# Altium schematic sheet 407-exp.schdoc
size A4
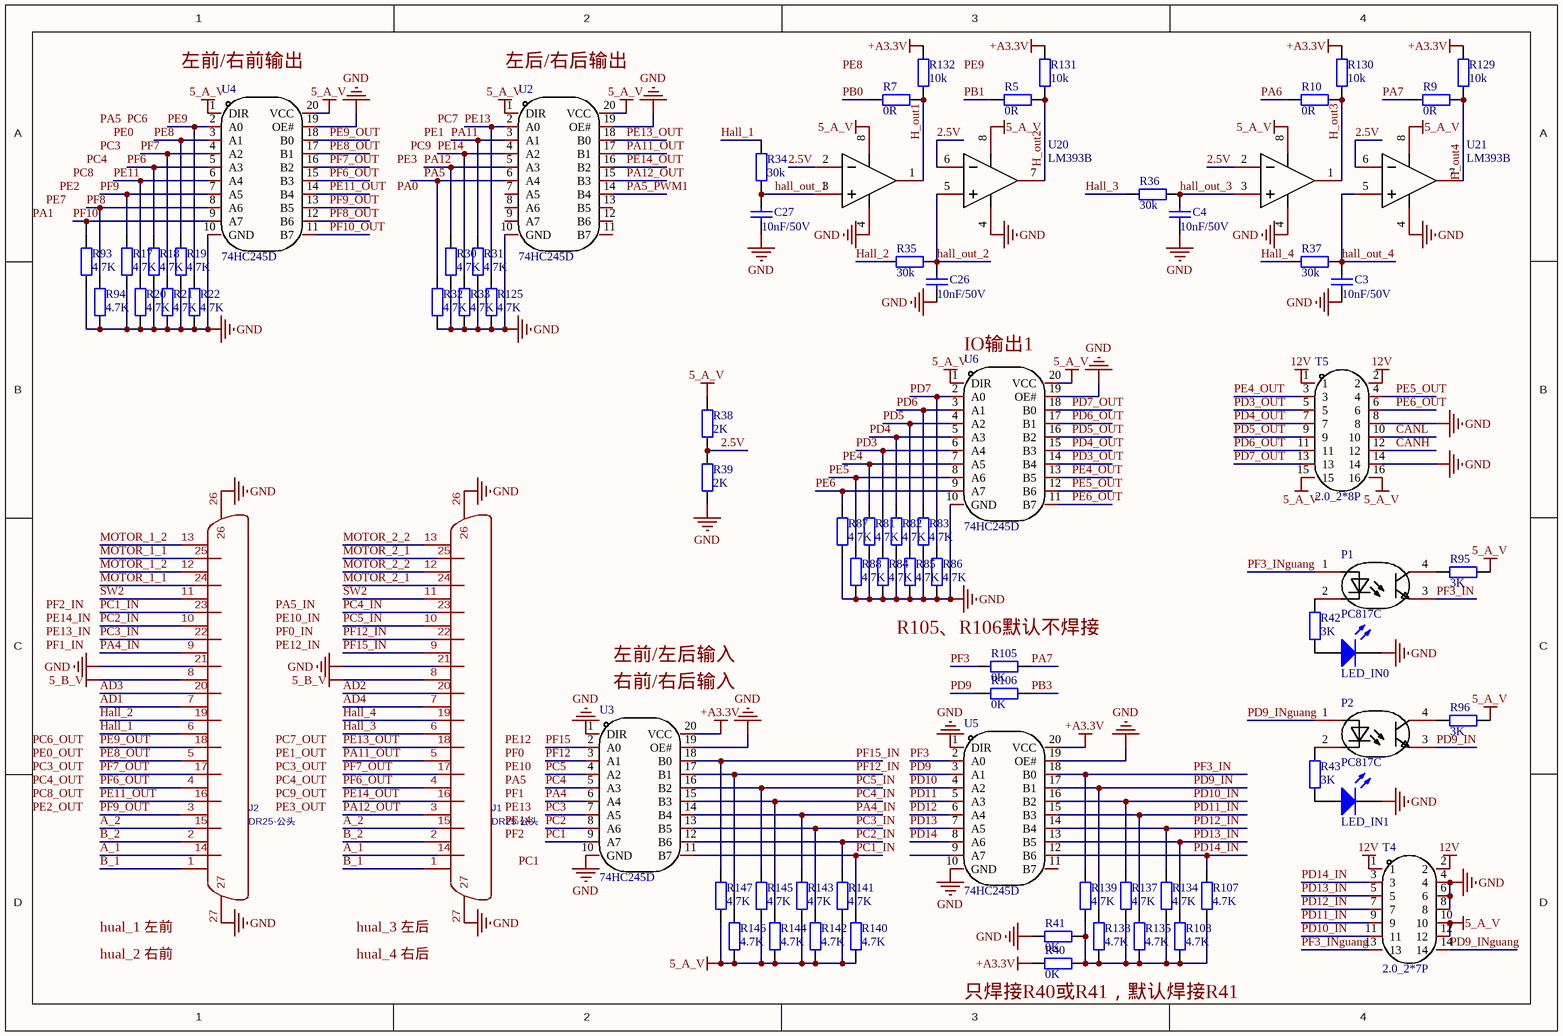
[diagram p0: 407-exp.schdoc]

## Parts
C3  10nF/50V
C4  10nF/50V
C26  10nF/50V
C27  10nF/50V
J1  DR25-公头
J2  DR25-公头
LED_IN0  LED  [LED]  (value not drawn)
LED_IN1  LED  [LED]  (value not drawn)
P1  PC817C  [PC817C]
P2  PC817C  [PC817C]
R5  0R  [R0603_L]
R7  0R  [R0603_L]
R9  0R  [R0603_L]
R10  0R  [R0603_L]
R17  4.7K  [R0603_L]
R18  4.7K  [R0603_L]
R19  4.7K  [R0603_L]
R20  4.7K  [R0603_L]
R21  4.7K  [R0603_L]
R22  4.7K  [R0603_L]
R30  4.7K  [R0603_L]
R31  4.7K  [R0603_L]
R32  4.7K  [R0603_L]
R33  4.7K  [R0603_L]
R34  30k  [R0603_L]
R35  30k  [R0603_L]
R36  30k  [R0603_L]
R37  30k  [R0603_L]
R38  2K
R39  2K
R40  0K  [R0603_L]
R41  0K  [R0603_L]
R42  3K
R43  3K
R81  4.7K
R82  4.7K
R83  4.7K
R84  4.7K
R85  4.7K
R86  4.7K
R87  4.7K
R88  4.7K
R93  4.7K  [R0603_L]
R94  4.7K  [R0603_L]
R95  3K
R96  3K
R105  0K  [R0603_L]
R106  0K  [R0603_L]
R107  4.7K
R108  4.7K
R125  4.7K  [R0603_L]
R129  10k  [R0603_L]
R130  10k  [R0603_L]
R131  10k  [R0603_L]
R132  10k  [R0603_L]
R134  4.7K
R135  4.7K
R137  4.7K
R138  4.7K
R139  4.7K
R140  4.7K  [R0603_L]
R141  4.7K  [R0603_L]
R142  4.7K  [R0603_L]
R143  4.7K  [R0603_L]
R144  4.7K  [R0603_L]
R145  4.7K  [R0603_L]
R146  4.7K  [R0603_L]
R147  4.7K  [R0603_L]
T4  2.0_2*7P  [2.0_2*7P]
T5  2.0_2*8P  [2.0_2*8P]
U2  74HC245D  [74HC245D]
U3  74HC245D  [74HC245D]
U4  74HC245D  [74HC245D]
U5  74HC245D  [74HC245D]
U6  74HC245D  [74HC245D]
U20  LM393B  [LM393B]
U21  LM393B  [LM393B]

## Nets
5_A_V: R38.1 R95.2 R96.2 R140.1 R141.1 R142.1 R143.1 R144.1 R145.1 R146.1 R147.1 T4.10 T4.12 T5.15 T5.16 U2.1(DIR) U2.20(VCC) U4.1(DIR) U4.20(VCC) U6.1(DIR) U6.20(VCC) U20.8(VCC) U21.8(VCC)
5_B_V: J1.8 J2.8
12V: T4.1 T4.2 T5.1 T5.2
+A3.3V: R40.1 R129.1 R130.1 R131.1 R132.1 U3.20(VCC) U5.20(VCC)
GND: C3.2 C4.2 C26.2 C27.2 J1.21 J1.26 J1.27 J2.21 J2.26 J2.27 LED_IN0.2(K) LED_IN1.2(K) R17.1 R18.1 R19.1 R20.1 R21.1 R22.1 R30.1 R31.1 R32.1 R33.1 R39.2 R41.1 R81.1 R82.1 R83.1 R84.1 R85.1 R86.1 R87.1 R88.1 R93.1 R94.1 R125.1 T4.4 T4.6 T4.8 T5.8 T5.14 U2.10(GND) U2.19(OE#) U3.1(DIR) U3.10(GND) U3.19(OE#) U4.10(GND) U4.19(OE#) U5.1(DIR) U5.10(GND) U5.19(OE#) U6.10(GND) U6.19(OE#) U20.4(GND) U21.4(GND)
2.5V: R38.2 R39.1 U20.2(1IN-) U20.6(1IN-) U21.2(1IN-) U21.6(1IN-)
A_1: J1.14 J2.14
A_2: J1.15 J2.15
AD1: J2.7
AD2: J1.20
AD3: J2.20
AD4: J1.7
B_1: J1.1 J2.1
B_2: J1.2 J2.2
CANH: T5.12
CANL: T5.10
H_out1: R7.2 R132.2 U20.1(1OUT)
H_out2: R5.2 R131.2 U20.7(1OUT)
H_out3: R10.2 R130.2 U21.1(1OUT)
H_out4: R9.2 R129.2 U21.7(1OUT)
Hall_1: J2.6 R34.1
Hall_2: J2.19 R35.1
Hall_3: J1.6 R36.1
Hall_4: J1.19 R37.1
hall_out_1: C27.1 R34.2 U20.3(1IN+)
hall_out_2: C26.1 R35.2 U20.5(1IN+)
hall_out_3: C4.1 R36.2 U21.3(1IN+)
hall_out_4: C3.1 R37.2 U21.5(1IN+)
MOTOR_1_1: J2.24 J2.25
MOTOR_1_2: J2.12 J2.13
MOTOR_2_1: J1.24 J1.25
MOTOR_2_2: J1.12 J1.13
PA4: U3.6(A4)
PA4_IN: J2.9 R143.2 U3.14(B4)
PA5: R32.2 U2.6(A4)
PA5_PWM1: U2.14(B4)
PA6: R10.1
PA7: R9.1 R105.1
PA11: R31.2 U2.3(A1)
PA11_OUT: J1.5 U2.17(B1)
PA12: R30.2 U2.5(A3)
PA12_OUT: J1.3 U2.15(B3)
PB0: R7.1
PB1: R5.1
PB3: R106.1
PC1: U3.9(A7)
PC1_IN: J2.23 R140.2 U3.11(B7)
PC2: U3.8(A6)
PC2_IN: J2.10 R141.2 U3.12(B6)
PC3: U3.7(A5)
PC3_IN: J2.22 R142.2 U3.13(B5)
PC4: U3.5(A3)
PC4_IN: J1.23 R144.2 U3.15(B3)
PC5: U3.4(A2)
PC5_IN: J1.10 R145.2 U3.16(B2)
PD3: R84.2 U6.6(A4)
PD3_OUT: T5.5 U6.14(B4)
PD4: R82.2 U6.5(A3)
PD4_OUT: T5.7 U6.15(B3)
PD5: R85.2 U6.4(A2)
PD5_OUT: T5.9 U6.16(B2)
PD6: R83.2 U6.3(A1)
PD6_OUT: T5.11 U6.17(B1)
PD7: R86.2 U6.2(A0)
PD7_OUT: T5.13 U6.18(B0)
PD9: R106.2 U5.3(A1)
PD9_IN: P2.3 R138.2 U5.17(B1)
PD9_INguang: P2.1 T4.14
PD10: U5.4(A2)
PD10_IN: R137.2 T4.11 U5.16(B2)
PD11: U5.5(A3)
PD11_IN: R135.2 T4.9 U5.15(B3)
PD12: U5.6(A4)
PD12_IN: R134.2 T4.7 U5.14(B4)
PD13: U5.7(A5)
PD13_IN: R108.2 T4.5 U5.13(B5)
PD14: U5.8(A6)
PD14_IN: R107.2 T4.3 U5.12(B6)
PE4: R81.2 U6.7(A5)
PE4_OUT: T5.3 U6.13(B5)
PE5: R88.2 U6.8(A6)
PE5_OUT: T5.4 U6.12(B6)
PE6: R87.2 U6.9(A7)
PE6_OUT: T5.6 U6.11(B7)
PE8: R19.2 U4.3(A1)
PE8_OUT: J2.5 U4.17(B1)
PE9: R22.2 U4.2(A0)
PE9_OUT: J2.18 U4.18(B0)
PE11: R20.2 U4.6(A4)
PE11_OUT: J2.16 U4.14(B4)
PE13: R125.2 U2.2(A0)
PE13_OUT: J1.18 U2.18(B0)
PE14: R33.2 U2.4(A2)
PE14_OUT: J1.16 U2.16(B2)
PF3: R105.2 U5.2(A0)
PF3_IN: P1.3 R139.2 U5.18(B0)
PF3_INguang: P1.1 T4.13
PF6: R18.2 U4.5(A3)
PF6_OUT: J1.4 J2.4 U4.15(B3)
PF7: R21.2 U4.4(A2)
PF7_OUT: J1.17 J2.17 U4.16(B2)
PF8: R94.2 U4.8(A6)
PF8_OUT: U4.12(B6)
PF9: R17.2 U4.7(A5)
PF9_OUT: J2.3 U4.13(B5)
PF10: R93.2 U4.9(A7)
PF10_OUT: U4.11(B7)
PF12: U3.3(A1)
PF12_IN: J1.22 R146.2 U3.17(B1)
PF15: U3.2(A0)
PF15_IN: J1.9 R147.2 U3.18(B0)
SW2: J1.11 J2.11
NetLED_IN0_1: LED_IN0.1(A) R42.1
NetLED_IN1_1: LED_IN1.1(A) R43.1
NetP1_2: P1.2 R42.2
NetP1_4: P1.4 R95.1
NetP2_2: P2.2 R43.2
NetP2_4: P2.4 R96.1
NetR40_2: R40.2 R41.2 R107.1 R108.1 R134.1 R135.1 R137.1 R138.1 R139.1

Not connected (* = marked no-connect by the designer): U2 7(A5) 8(A6) 9(A7) 11(B7) 12(B6) 13(B5); U5 9(A7) 11(B7)

## Notes on the sheet
- (near U4) 左前/右前输出
- (near U2) 左后/右后输出
- (near U6) IO输出1
- R105、R106默认不焊接
- (near U3) 右前/右后输入
- 左前/左后输入
- (near J2) hual_1 左前
- hual_2 右前
- (near J1) hual_3 左后
- hual_4 右后
- 只焊接R40或R41，默认焊接R41
- Labels drawn without touching a wire or pin: PA0, PA1, PA5, PA5_IN, PC1, PC3, PC3_OUT, PC4, PC4_OUT, PC6, PC6_OUT, PC7, PC7_OUT, PC8, PC8_OUT, PC9, PC9_OUT, PE0, PE0_OUT, PE1, PE1_OUT, PE2, PE2_OUT, PE3, PE3_OUT, PE7, PE8, PE9, PE10, PE10_IN, PE12, PE12_IN, PE13, PE13_IN, PE14, PE14_IN, PF0, PF0_IN, PF1, PF1_IN, PF2, PF2_IN

## Library data of the parts
C3 C4 C26 C27 = Cap: Capacitor; Published: 8-Jun-2000; LatestRevisionDate: 17-Jul-2002; LatestRevisionNote: Re-released for DXP Platform.; PackageReference: RAD-0.3; Publisher: Altium Limited; PackageDescription: Radial Cap, Thru-Hole; 2 Leads; 0.3 in Pin Spacing; Value: 10nF/50V
J1 J2 = DR25-公头: Manufacturer Part: DMR025PF000XH00; Contributor: MR_Peng888; Supplier: LCSC; Supplier Part: C190083; spicePre: D; spiceSymbolName: DR25-公头
LED_IN0 LED_IN1 = LED: 发光二极管; 封装库来自淘宝卖家ID：黄晶宝石: 其他店铺购入均为盗版封装库，请立即申请退款，本店现金奖励20~200元
R5 R7 R9 R10 R17-R22 R30-R39 R93 R94 R125 R129-R132 R140-R147 = Res2: Resistor; Value: 0K; Published: 8-Jun-2000; LatestRevisionDate: 17-Jul-2002; LatestRevisionNote: Re-released for DXP Platform.; PackageReference: AXIAL-0.4; Publisher: Altium Limited; PackageDescription: Axial Device, Thru-Hole; 2 Leads; 0.4 in Pin Spacing
R40 R41 R81-R88 R105-R108 R134 R135 R137-R139 = Res2: Resistor; Published: 8-Jun-2000; LatestRevisionDate: 17-Jul-2002; LatestRevisionNote: Re-released for DXP Platform.; PackageReference: AXIAL-0.4; Publisher: Altium Limited; PackageDescription: Axial Device, Thru-Hole; 2 Leads; 0.4 in Pin Spacing
  R40 R41 R105 R106: Value: 0K
  R81-R88 R107 R108 R134 R135 R137-R139: Value: 4.7K
R42 R43 R95 R96 = Res2: Resistor; Value: 4.7K; Published: 8-Jun-2000; LatestRevisionDate: 17-Jul-2002; LatestRevisionNote: Re-released for DXP Platform.; PackageReference: AXIAL-0.4; Publisher: Altium Limited; PackageDescription: Axial Device, Thru-Hole; 2 Leads; 0.4 in Pin Spacing